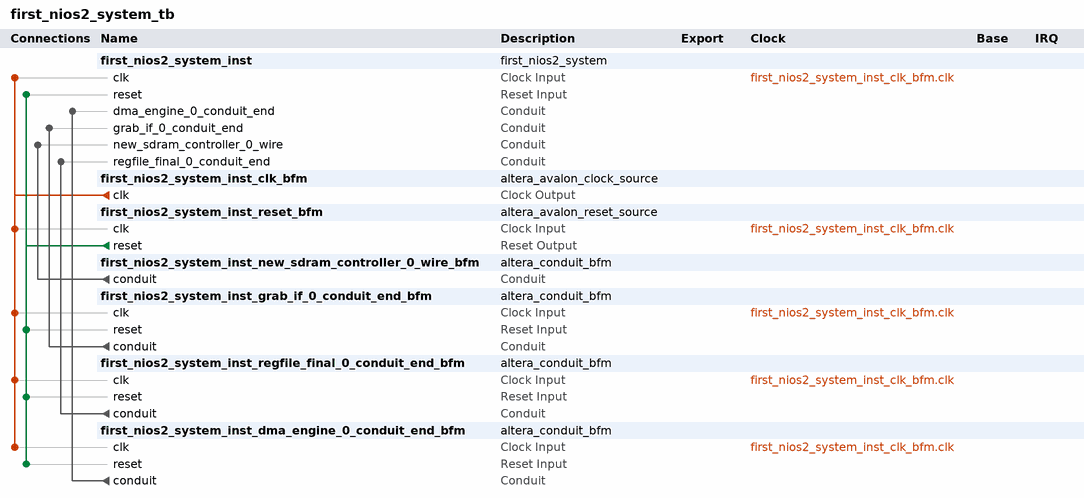
[diagram p0: system contents]
# Platform Designer (Qsys) system first_nios2_system_tb, Cyclone II EP2C35F672C6
# Parameters at their usual value, and those the tool derives, are not listed.
package require -exact qsys 13.0
create_system first_nios2_system_tb
set_project_property DEVICE_FAMILY {Cyclone II}
set_project_property DEVICE EP2C35F672C6

add_instance first_nios2_system_inst first_nios2_system 1.0

add_instance first_nios2_system_inst_clk_bfm altera_avalon_clock_source 13.0
set_instance_parameter_value first_nios2_system_inst_clk_bfm CLOCK_RATE 100000000

add_instance first_nios2_system_inst_reset_bfm altera_avalon_reset_source 13.0
set_instance_parameter_value first_nios2_system_inst_reset_bfm ASSERT_HIGH_RESET 0
set_instance_parameter_value first_nios2_system_inst_reset_bfm INITIAL_RESET_CYCLES 50

add_instance first_nios2_system_inst_new_sdram_controller_0_wire_bfm altera_conduit_bfm 13.0
set_instance_parameter_value first_nios2_system_inst_new_sdram_controller_0_wire_bfm CLOCKED_SIGNAL false
set_instance_parameter_value first_nios2_system_inst_new_sdram_controller_0_wire_bfm ENABLE_RESET false
set_instance_parameter_value first_nios2_system_inst_new_sdram_controller_0_wire_bfm SIGNAL_ROLES addr,ba,cas_n,cke,cs_n,dq,dqm,ras_n,we_n
set_instance_parameter_value first_nios2_system_inst_new_sdram_controller_0_wire_bfm SIGNAL_WIDTHS 12,2,1,1,1,16,2,1,1
set_instance_parameter_value first_nios2_system_inst_new_sdram_controller_0_wire_bfm SIGNAL_DIRECTIONS input,input,input,input,input,bidir,input,input,input

add_instance first_nios2_system_inst_grab_if_0_conduit_end_bfm altera_conduit_bfm 13.0
set_instance_parameter_value first_nios2_system_inst_grab_if_0_conduit_end_bfm CLOCKED_SIGNAL true
set_instance_parameter_value first_nios2_system_inst_grab_if_0_conduit_end_bfm ENABLE_RESET true
set_instance_parameter_value first_nios2_system_inst_grab_if_0_conduit_end_bfm SIGNAL_ROLES GSSHT,GMODE,GCONT,GFMT,GFSTART,GLPITCH,GYSS,GXSS,GACTIVE,GSPDG,DEBUG_GRABIF1,DEBUG_GRABIF2,vdata,gclk
set_instance_parameter_value first_nios2_system_inst_grab_if_0_conduit_end_bfm SIGNAL_WIDTHS 1,2,1,1,23,23,2,2,1,1,32,32,8,1
set_instance_parameter_value first_nios2_system_inst_grab_if_0_conduit_end_bfm SIGNAL_DIRECTIONS output,output,output,output,output,output,output,output,input,input,input,input,output,output

add_instance first_nios2_system_inst_regfile_final_0_conduit_end_bfm altera_conduit_bfm 13.0
set_instance_parameter_value first_nios2_system_inst_regfile_final_0_conduit_end_bfm CLOCKED_SIGNAL true
set_instance_parameter_value first_nios2_system_inst_regfile_final_0_conduit_end_bfm ENABLE_RESET true
set_instance_parameter_value first_nios2_system_inst_regfile_final_0_conduit_end_bfm SIGNAL_ROLES GSPDG,GACTIVE,GFMT,GMODE,GXSS,GYSS,GFSTART,GLPITCH,SOFIEN,DMAEN,DMALR,DMAFSTART,DMALPITCH,DMAXSIZE,VGAHZOOM,VGAVZOOM,PFMT,HTOTAL,HSSYNC,HESYNC,HSVALID,HEVALID,VTOTAL,VSSYNC,VESYNC,VSVALID,VEVALID,GACTIVE_IN,GSPDG_IN,GSSHT,SOFISTS,EOFIEN
set_instance_parameter_value first_nios2_system_inst_regfile_final_0_conduit_end_bfm SIGNAL_WIDTHS 1,1,1,2,2,2,23,23,1,1,1,23,23,16,2,2,2,16,16,16,16,16,16,16,16,16,16,1,1,1,1,1
set_instance_parameter_value first_nios2_system_inst_regfile_final_0_conduit_end_bfm SIGNAL_DIRECTIONS input,input,input,input,input,input,input,input,input,input,input,input,input,input,input,input,input,input,input,input,input,input,input,input,input,input,input,output,output,input,input,input

add_instance first_nios2_system_inst_dma_engine_0_conduit_end_bfm altera_conduit_bfm 13.0
set_instance_parameter_value first_nios2_system_inst_dma_engine_0_conduit_end_bfm CLOCKED_SIGNAL true
set_instance_parameter_value first_nios2_system_inst_dma_engine_0_conduit_end_bfm ENABLE_RESET true
set_instance_parameter_value first_nios2_system_inst_dma_engine_0_conduit_end_bfm SIGNAL_ROLES DMAEN,DMALR,DMAFSTART,DMALPITCH,DMAXSIZE,data,read_address,write_address,write_enable,read_enable
set_instance_parameter_value first_nios2_system_inst_dma_engine_0_conduit_end_bfm SIGNAL_WIDTHS 1,1,23,23,16,32,11,11,1,1
set_instance_parameter_value first_nios2_system_inst_dma_engine_0_conduit_end_bfm SIGNAL_DIRECTIONS output,output,output,output,output,input,output,input,input,output

# connections
add_connection first_nios2_system_inst_clk_bfm.clk first_nios2_system_inst.clk clock
add_connection first_nios2_system_inst_clk_bfm.clk first_nios2_system_inst_dma_engine_0_conduit_end_bfm.clk clock
add_connection first_nios2_system_inst_clk_bfm.clk first_nios2_system_inst_grab_if_0_conduit_end_bfm.clk clock
add_connection first_nios2_system_inst_clk_bfm.clk first_nios2_system_inst_regfile_final_0_conduit_end_bfm.clk clock
add_connection first_nios2_system_inst_clk_bfm.clk first_nios2_system_inst_reset_bfm.clk clock
add_connection first_nios2_system_inst_reset_bfm.reset first_nios2_system_inst.reset reset
add_connection first_nios2_system_inst_reset_bfm.reset first_nios2_system_inst_dma_engine_0_conduit_end_bfm.reset reset
add_connection first_nios2_system_inst_reset_bfm.reset first_nios2_system_inst_grab_if_0_conduit_end_bfm.reset reset
add_connection first_nios2_system_inst_reset_bfm.reset first_nios2_system_inst_regfile_final_0_conduit_end_bfm.reset reset
add_connection first_nios2_system_inst_dma_engine_0_conduit_end_bfm.conduit first_nios2_system_inst.dma_engine_0_conduit_end conduit
add_connection first_nios2_system_inst_grab_if_0_conduit_end_bfm.conduit first_nios2_system_inst.grab_if_0_conduit_end conduit
add_connection first_nios2_system_inst_new_sdram_controller_0_wire_bfm.conduit first_nios2_system_inst.new_sdram_controller_0_wire conduit
add_connection first_nios2_system_inst_regfile_final_0_conduit_end_bfm.conduit first_nios2_system_inst.regfile_final_0_conduit_end conduit

set_interconnect_requirement {$system} qsys_mm.clockCrossingAdapter HANDSHAKE
set_interconnect_requirement {$system} qsys_mm.maxAdditionalLatency 1

save_system first_nios2_system_tb.qsys
